# Altium project AAS_module_rev1_2.PrjPcb
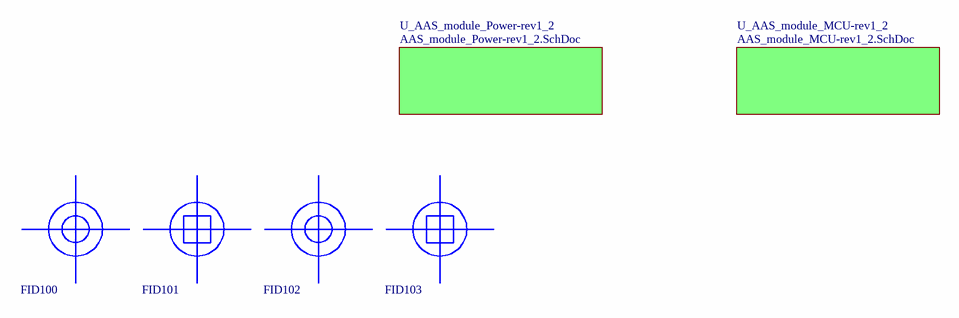
[diagram p0: AAS_module_TOP-rev1_2.SchDoc]
ProjecTevisionDate: 14; ProjectNameText: AAS module / Gateway; ProjectRevision: 1.2
4 sheets, 126 parts. Net scope: hierarchical (ports join the sheet entries above them; power ports are global).
Board files: AAS_module_rev1_2.PcbDoc, AAS_module_rev1_2_PANEL.PcbDoc
Sheets:
  AAS_module_TOP-rev1_2.SchDoc
    U_AAS_module_Power-rev1_2 = AAS_module_Power-rev1_2.SchDoc
    U_AAS_module_MCU-rev1_2 = AAS_module_MCU-rev1_2.SchDoc
      Designator = AAS_module_Touch-rev1_2.SchDoc

## Sheet AAS_module_TOP-rev1_2.SchDoc: TOP
size A4; Author: Richard Kubíček; DocumentNumber: 1; SheetNumber: 1; SheetTotal: 4; PageSize: A4; DruhPraceRadek1: Diplomová; DruhPraceRadek2: práce

### Parts
FID100  FID_CIRCLE  [FID-CIRCLE1MM]  (value not drawn)
FID101  FID_SQUARE  [FID-SQUARE1MM]  (value not drawn)
FID102  FID_CIRCLE  [FID-CIRCLE1MM]  (value not drawn)
FID103  FID_SQUARE  [FID-SQUARE1MM]  (value not drawn)

### Sub-sheets
U_AAS_module_MCU-rev1_2 = AAS_module_MCU-rev1_2.SchDoc: no entries
U_AAS_module_Power-rev1_2 = AAS_module_Power-rev1_2.SchDoc: no entries

### Notes on the sheet
- Druh práce
- Název dokumentu
- Projekt
- Autor
- Revize
- Strana

## Sheet AAS_module_Power-rev1_2.SchDoc: Power
size A3; Author: Richard Kubíček; DocumentNumber: 4; SheetNumber: 4; SheetTotal: 4; PageSize: A3; DruhPraceRadek1: Diplomová; DruhPraceRadek2: práce
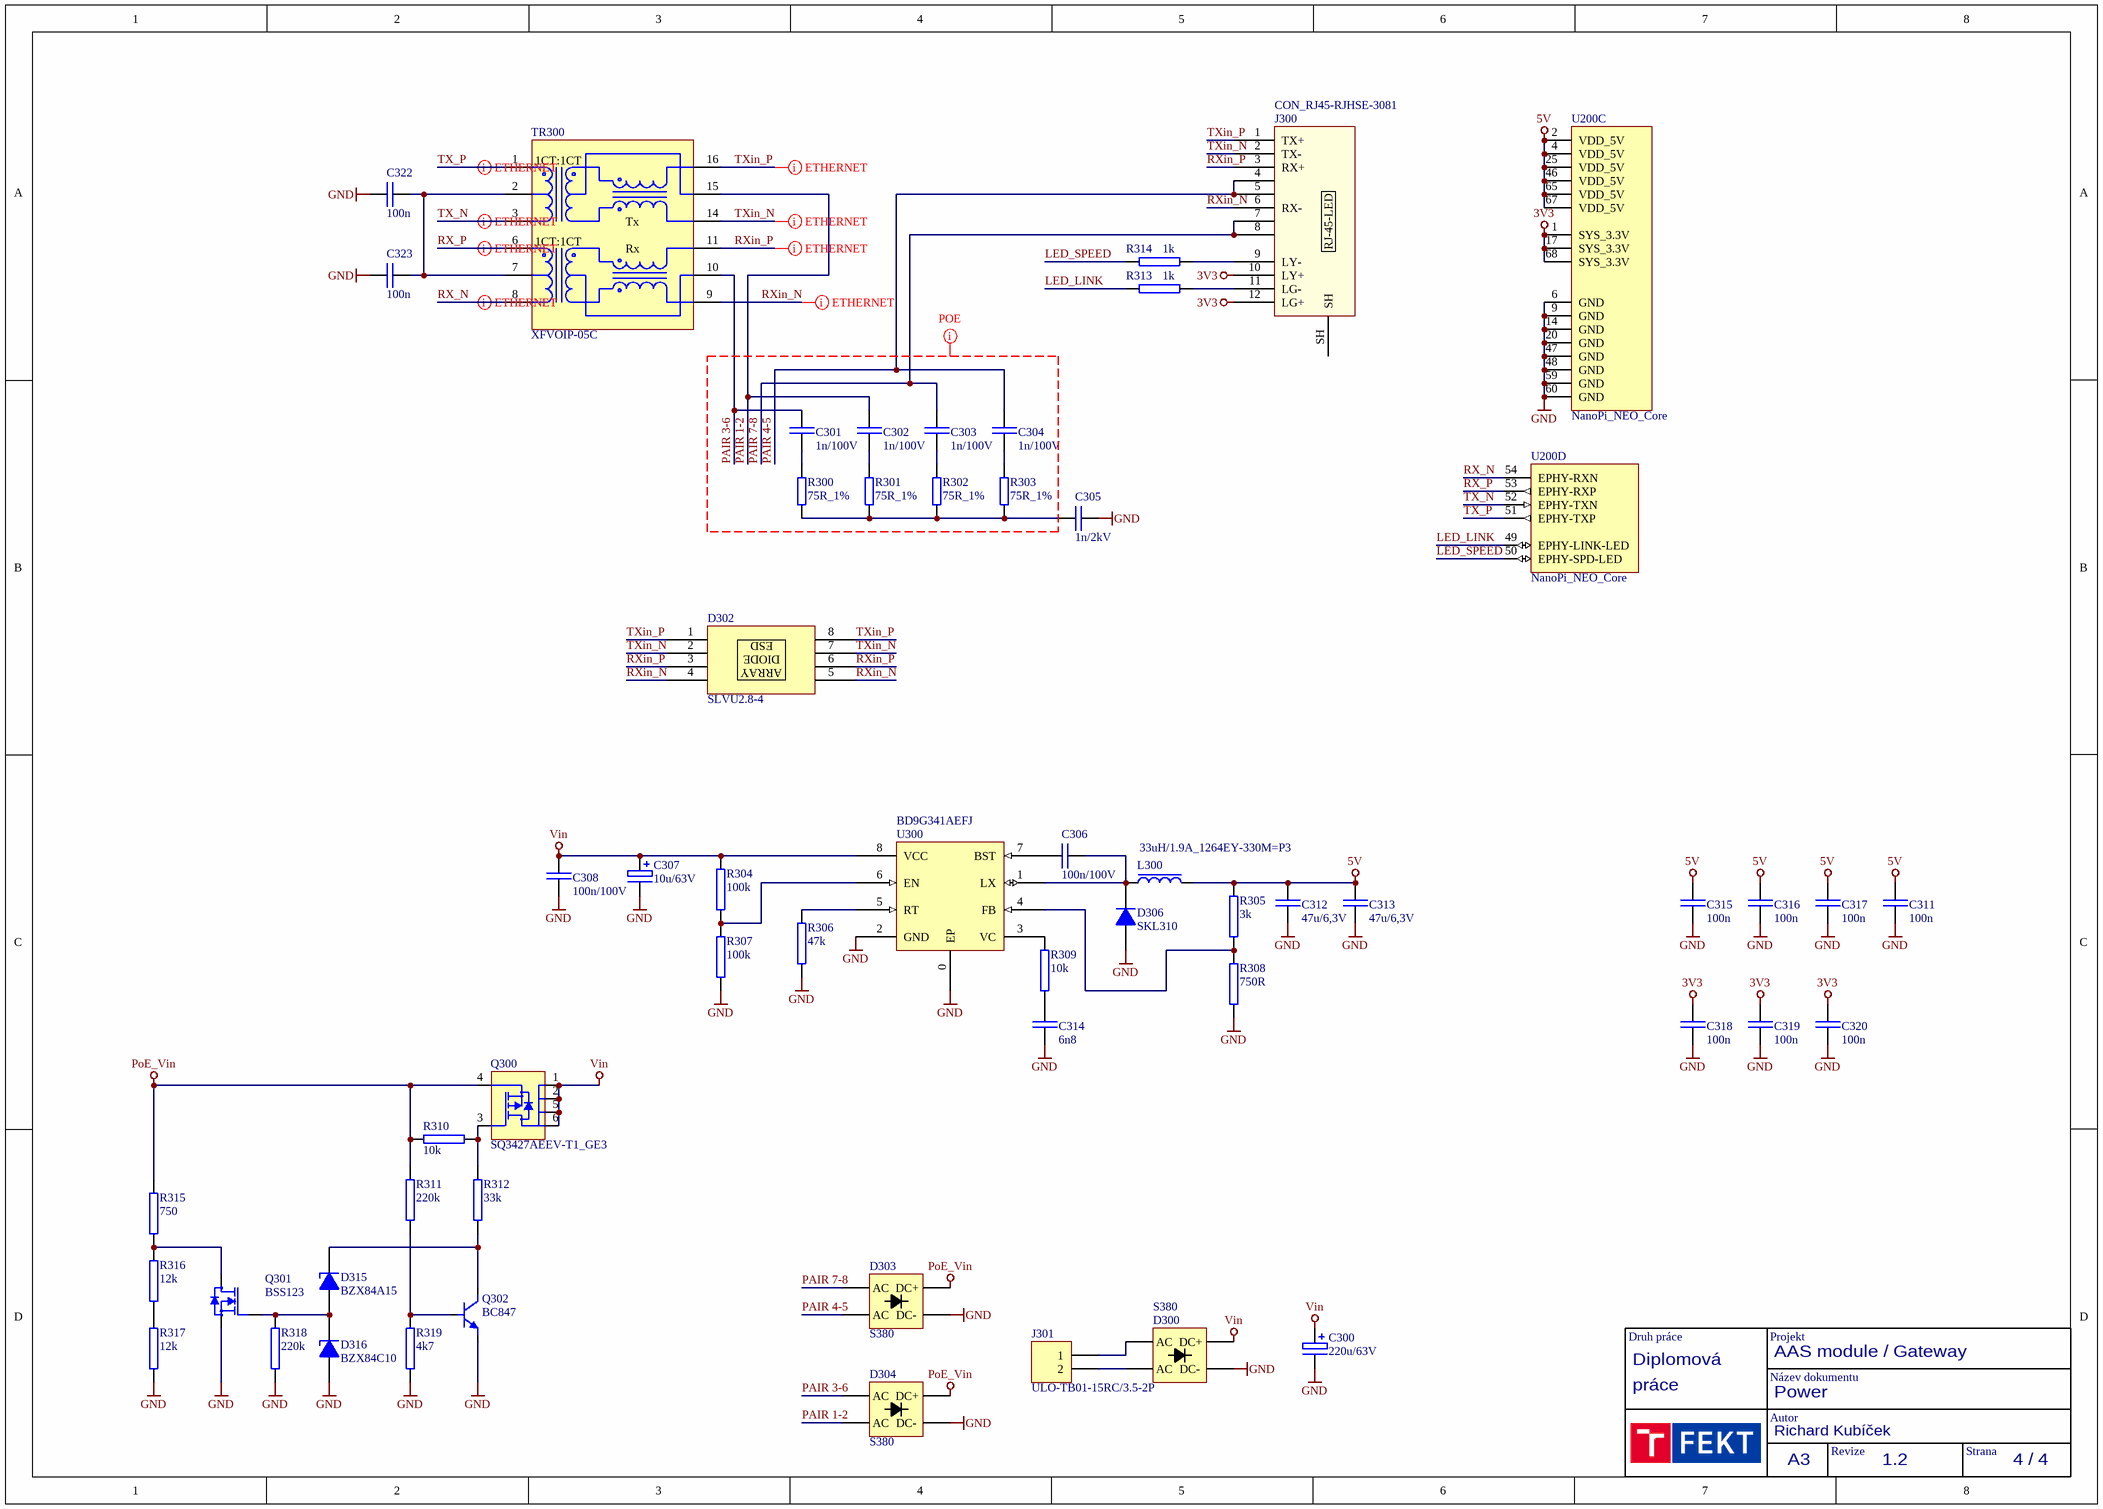
[diagram p1: AAS_module_Power-rev1_2.SchDoc]

### Parts
C300  220u/63V  [CAP_D10xL20_P5_HR]
C301  1n/100V  [C0603]
C302  1n/100V  [C0603]
C303  1n/100V  [C0603]
C304  1n/100V  [C0603]
C305  1n/2kV  [C1206]
C306  100n/100V  [C1206]
C307  10u/63V  [C_ALU_D6x5.8]
C308  100n/100V  [C1206]
C311  100n  [C0603]
C312  47u/6,3V  [C1206]
C313  47u/6,3V  [C1206]
C314  6n8  [C0805]
C315  100n  [C0603]
C316  100n  [C0603]
C317  100n  [C0603]
C318  100n  [C0603]
C319  100n  [C0603]
C320  100n  [C0603]
C322  100n  [C0603]
C323  100n  [C0603]
D300  S380  [MBS]
D302  SLVU2.8-4  [SO-8]
D303  S380  [MBS]
D304  S380  [MBS]
D306  SKL310  [SOD123]
D315  BZX84A15  [SOT-23]
D316  BZX84C10  [SOT-23]
J300  CON_RJ45-RJHSE-3081  [RJHSE-3081]
J301  ULO-TB01-15RC/3.5-2P  [ULO-TB01-15VC-3.5-2P]
L300  33uH/1.9A_1264EY-330M=P3  [L_MURATA-DG6050C]
Q300  SQ3427AEEV-T1_GE3  [SOT-23-6]
Q301  BSS123  [SOT-23]
Q302  BC847  [SOT-23]
R300  75R_1%  [R_0805]
R301  75R_1%  [R_0805]
R302  75R_1%  [R_0805]
R303  75R_1%  [R_0805]
R304  100k  [R0603]
R305  3k  [R0603]
R306  47k  [R0603]
R307  100k  [R0603]
R308  750R  [R0603]
R309  10k  [R0603]
R310  10k  [R0603]
R311  220k  [R0603]
R312  33k  [R0603]
R313  1k  [R0603]
R314  1k  [R0603]
R315  750  [R0603]
R316  12k  [R0603]
R317  12k  [R0603]
R318  220k  [R0603]
R319  4k7  [R0603]
TR300  XFVOIP-05C  [XFVOIP-05]
U200  NanoPi_NEO_Core  [NanoPi_NEO_Core_right]  (parts C,D of 4)
U300  BD9G341AEFJ  [SO-8_EP]

### Nets
3V3: C318.1 C319.1 C320.1 J300.10(LY+) J300.12(LG+) U200.1(SYS_3.3V) U200.17(SYS_3.3V) U200.68(SYS_3.3V)
5V: C311.1 C312.1 C313.1 C315.1 C316.1 C317.1 L300.2 R305.2 U200.2(VDD_5V) U200.4(VDD_5V) U200.25(VDD_5V) U200.46(VDD_5V) U200.65(VDD_5V) U200.67(VDD_5V)
GND: C300.2(-) C305.2 C307.2(-) C308.2 C311.2 C312.2 C313.2 C314.1 C315.2 C316.2 C317.2 C318.2 C319.2 C320.2 C322.1 C323.1 D300.2(DC-) D303.2(DC-) D304.2(DC-) D306.A D316.A Q301.S Q302.E R306.1 R307.1 R308.1 R317.1 R318.1 R319.1 U200.6(GND) U200.9(GND) U200.14(GND) U200.20(GND) U200.47(GND) U200.48(GND) U200.59(GND) U200.60(GND) U300.0(EP) U300.2(GND)
PoE_Vin: D303.1(DC+) D304.1(DC+) Q300.4(S) R310.2 R311.2 R315.2
Vin: C300.1(+) C307.1(+) C308.1 D300.1(DC+) Q300.1(D) Q300.2(D) Q300.5(D) Q300.6(D) R304.2 U300.8(VCC)
LED_LINK: R313.2 U200.49(EPHY-LINK-LED)
LED_SPEED: R314.2 U200.50(EPHY-SPD-LED)
PAIR 1-2: C302.1 D304.4(AC) TR300.15(TXCT)
PAIR 3-6: C301.1 D304.3(AC) TR300.10(RXCT)
PAIR 4-5: C304.1 D303.4(AC) J300.4 J300.5
PAIR 7-8: C303.1 D303.3(AC) J300.7 J300.8
RX_N: TR300.8(RD-) U200.54(EPHY-RXN)
RX_P: TR300.6(RD+) U200.53(EPHY-RXP)
RXin_N: D302.4 D302.5 J300.6(RX-) TR300.9(RX1-)
RXin_P: D302.3 D302.6 J300.3(RX+) TR300.11(RX1+)
TX_N: TR300.3(TD-) U200.52(EPHY-TXN)
TX_P: TR300.1(TD+) U200.51(EPHY-TXP)
TXin_N: D302.2 D302.7 J300.2(TX-) TR300.14(TX1-)
TXin_P: D302.1 D302.8 J300.1(TX+) TR300.16(TX1+)
NetC301_2: C301.2 R300.2
NetC302_2: C302.2 R301.2
NetC303_2: C303.2 R302.2
NetC304_2: C304.2 R303.2
NetC305_1: C305.1 R300.1 R301.1 R302.1 R303.1
NetC306_1: C306.1 U300.7(BST)
NetC306_2: C306.2 D306.K L300.1 U300.1(LX)
NetC314_2: C314.2 R309.1
NetC322_2: C322.2 C323.2 TR300.2(TCT) TR300.7(RCT)
NetD300_3: D300.3(AC) J301.1
NetD300_4: D300.4(AC) J301.2
NetD315_A: D315.A D316.K Q301.G R318.2
NetD315_K: D315.K Q302.C R312.1
NetJ300_9: J300.9(LY-) R314.1
NetJ300_11: J300.11(LG-) R313.1
NetQ300_3: Q300.3(G) R310.1 R312.2
NetQ301_D: Q301.D R315.1 R316.2
NetQ302_B: Q302.B R311.1 R319.2
NetR304_1: R304.1 R307.2 U300.6(EN)
NetR305_1: R305.1 R308.2 U300.4(FB)
NetR306_2: R306.2 U300.5(RT)
NetR309_2: R309.2 U300.3(VC)
NetR316_1: R316.1 R317.2

Not connected (* = marked no-connect by the designer): J300 SH; TR300 4(NC) 5(NC) 12(NC) 13(NC)

### Layout directives
net class POE: PAIR 1-2, PAIR 3-6, PAIR 4-5, PAIR 7-8
differential pair: RX_N, RX_P, RXin_N, RXin_P, TX_N, TX_P, TXin_N, TXin_P

### Notes on the sheet
- Druh práce
- Název dokumentu
- Projekt
- Autor
- Revize
- Strana
- (in symbol CON_RJ45-LED_DESCRIPTION) RJ-45-LED
- (in symbol SLVU2.8-4) ESD; DIODE; ARRAY
- (in symbol XFVOIP-05) 1CT:1CT; Tx; Rx

### Library data of the parts
C300 = C_ELYT: Electrolytic Capacitor; TME: EGT477M1JI20RRSHP
C301-C304 C311 C315-C320 C322 C323 = C_0603: Capacitor SMD 0603
C305 C306 C308 C312 C313 = C_1206: Capacitor SMD 1206
C307 = C_ALU: Electrolytic Aluminium Capacitor
C314 = C_0805: Capacitor SMD 0805
D300 D303 D304 = _DIODE_BRIDGE_RECTIFIER: Diode rectifier
D302 = SLVU2.8-4: EPD TVS Diode Array  For ESD and Latch-Up Protection
D306 = 1N4007: Diode
D315 D316 = BZX84CXXX: Zener diode; pin to pad: A>1 K>3
J300 = CON_RJ45-LED_DESCRIPTION
J301 = CON_ULO-TB01-15RC/3.5-2P: Connector 15EDG pitch 3.5mm Right Angle
L300 = 44: ID: 44; ABRA number: 94369; UR: 1; Value: 1264EY-330M=P3; Induction: 33uH/1.9A; Technology: SMT; Supplier 1: https://cz.mouser.com/ProductDetail/Murata-Electronics/1264EY-330M%3dP3?qs=sGAEpiMZZMsg%252by3WlYCkU588IWvyRtFzXhS%252bh6Vmel8%3d
Q300 = 38: ID: 38; UR: 1; Value: SQ3427AEEV-T1_GE3; HelpURL: https://cz.mouser.com/ProductDetail/Vishay-Siliconix/SQ3427AEEV-T1_GE3?qs=sGAEpiMZZMshyDBzk1%2FWi7D7EaJfF%252Bz4Xfx7fw3JA1J5zUvCnpY8Yg%3D%3D; Technology: SMT
Q301 = BSS138: N-Channel MOSFET; pin to pad: D>3 G>1 S>2
Q302 = BC847: NPN Transistor; pin to pad: B>1 C>3 E>2
R300-R303 = 101: ID: 101; Value: 75R; Tolerance: 1; ABRA number: 120149; ABS: 75; Technology: SMT; UR: 1
R304-R319 = R_0603: Resistor SMD 0603
TR300 = XFVOIP-05: LAN magnetics with filter; LCSC: HY601742
U300 = BD9G341AEFJ: 12V to 76V input voltage range 3A output current

## Sheet AAS_module_MCU-rev1_2.SchDoc: MCU
size A3; Author: Richard Kubíček; DocumentNumber: 2; SheetNumber: 2; SheetTotal: 4; PageSize: A3; DruhPraceRadek1: Diplomová; DruhPraceRadek2: práce
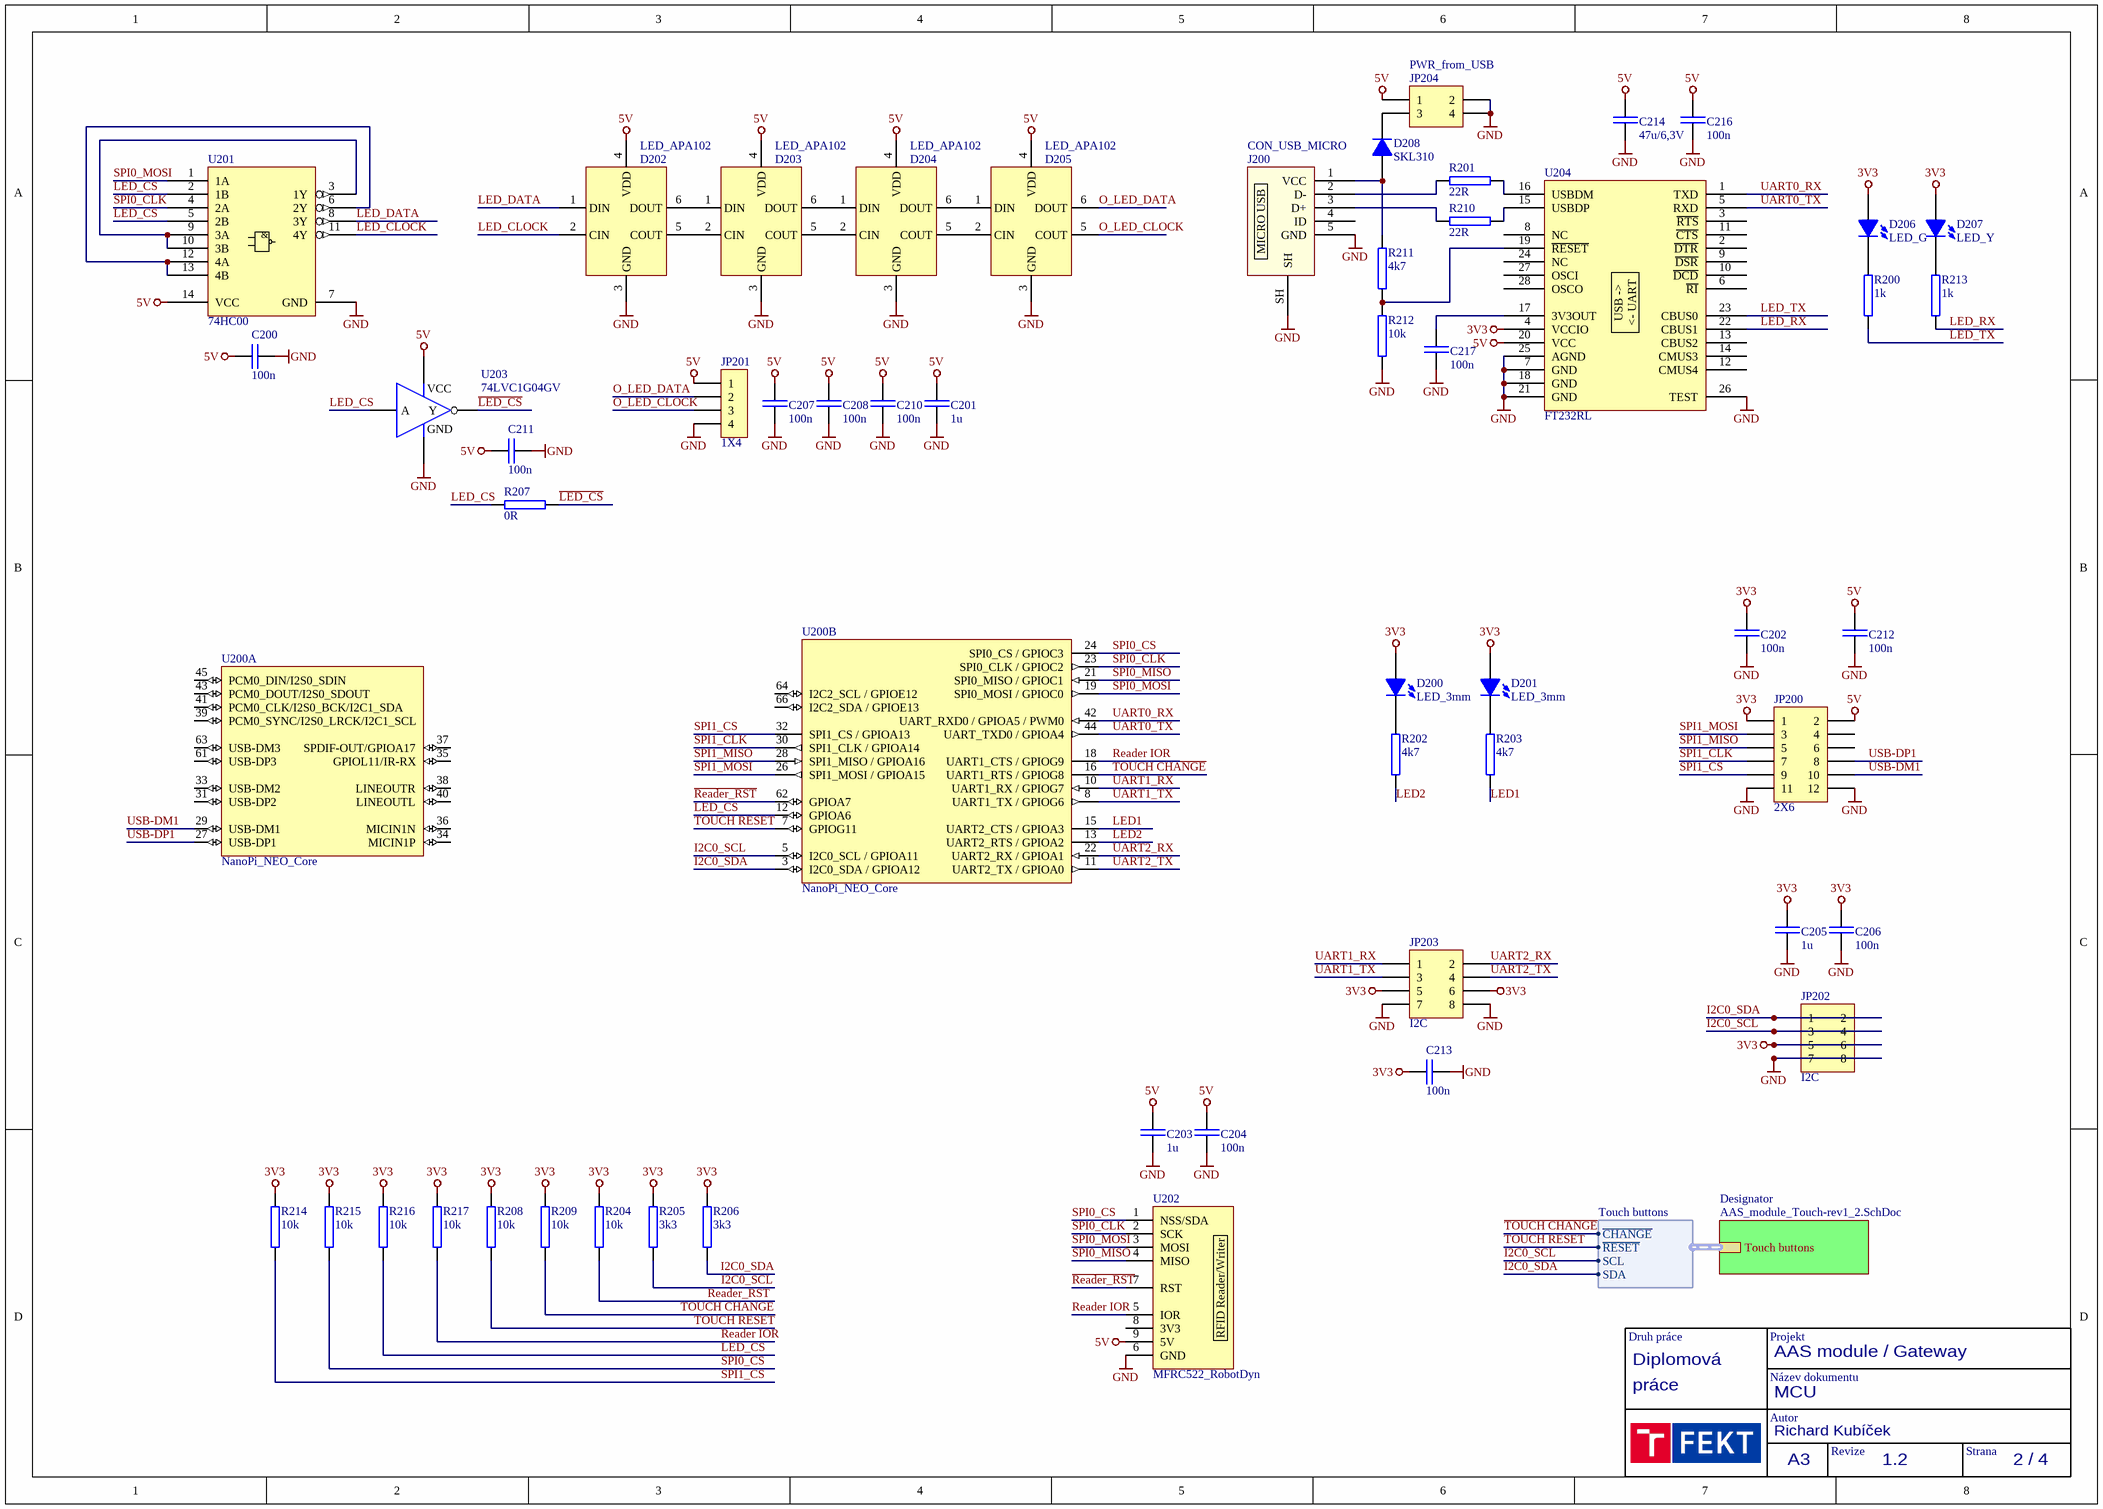
[diagram p2: AAS_module_MCU-rev1_2.SchDoc]

### Parts
C200  100n  [C0603]
C201  1u  [C0603]
C202  100n  [C0603]
C203  1u  [C0603]
C204  100n  [C0603]
C205  1u  [C0603]
C206  100n  [C0603]
C207  100n  [C0603]
C208  100n  [C0603]
C210  100n  [C0603]
C211  100n  [C0603]
C212  100n  [C0603]
C213  100n  [C0603]
C214  47u/6,3V  [C1206]
C216  100n  [C0603]
C217  100n  [C0603]
D200  LED_3mm  [LED_THT_3MM_P2.5_GREEN]
D201  LED_3mm  [LED_THT_3MM_P2.5_GREEN]
D202  LED_APA102  [APA102]
D203  LED_APA102  [APA102]
D204  LED_APA102  [APA102]
D205  LED_APA102  [APA102]
D206  LED_G  [LED_0603]
D207  LED_Y  [LED_0603]
D208  SKL310  [SOD123]
J200  CON_USB_MICRO  [MICRO USB-B SMD]
JP200  2X6  [HDR2x6]
JP201  1X4  [HDR1X4]
JP202  I2C  [HDR2X4]
JP203  I2C  [HDR2X4]
JP204  PWR_from_USB  [HDR2X2A]
R200  1k  [R0603]
R201  22R  [R0603]
R202  4k7  [R0603]
R203  4k7  [R0603]
R204  10k  [R0603]
R205  3k3  [R0603]
R206  3k3  [R0603]
R207  0R  [R0603]
R208  10k  [R0603]
R209  10k  [R0603]
R210  22R  [R0603]
R211  4k7  [R0603]
R212  10k  [R0603]
R213  1k  [R0603]
R214  10k  [R0603]
R215  10k  [R0603]
R216  10k  [R0603]
R217  10k  [R0603]
U200  NanoPi_NEO_Core  [NanoPi_NEO_Core_right]  (parts A,B of 4)
U201  74HC00  [SO-14]
U202  MFRC522_RobotDyn  [MFRC522_RobotDyn]
U203  74LVC1G04GV  [SOT-25]
U204  FT232RL  [SSOP-28]

### Sub-sheets
Designator = AAS_module_Touch-rev1_2.SchDoc: Touch buttons (harness Touch buttons)

### Harnesses
Touch buttons: ~{CHANGE}, ~{RESET}, SCL, SDA

### Nets
3V3: C202.1 C205.1 C206.1 C213.1 D200.A D201.A D206.A D207.A JP200.1 JP202.5 JP202.6 JP203.5 JP203.6 R204.2 R205.2 R206.2 R208.2 R209.2 R214.2 R215.2 R216.2 R217.2 U204.4(VCCIO)
5V: C200.1 C201.1 C203.1 C204.1 C207.1 C208.1 C210.1 C211.1 C212.1 C214.1 C216.2 D202.4(VDD) D203.4(VDD) D204.4(VDD) D205.4(VDD) JP200.2 JP201.1 JP204.1 U201.14(VCC) U202.9(5V) U203.5(VCC) U204.20(VCC)
GND: C200.2 C201.2 C202.2 C203.2 C204.2 C205.2 C206.2 C207.2 C208.2 C210.2 C211.2 C212.2 C213.2 C214.2 C216.1 C217.1 D202.3(GND) D203.3(GND) D204.3(GND) D205.3(GND) J200.5(GND) J200.SH JP200.11 JP200.12 JP201.4 JP202.7 JP202.8 JP203.7 JP203.8 JP204.2 JP204.4 R212.2 U201.7(GND) U202.6(GND) U203.3(GND) U204.7(GND) U204.18(GND) U204.21(GND) U204.25(AGND) U204.26(TEST)
I2C0_SCL: JP202.3 JP202.4 R205.1 U200.5(I2C0_SCL_/_GPIOA11) ; sheet Designator/Touch buttons.SCL
I2C0_SDA: JP202.1 JP202.2 R206.1 U200.3(I2C0_SDA_/_GPIOA12) ; sheet Designator/Touch buttons.SDA
~{LED_CS}: R207.1 U201.2(1B) U201.5(2B) U203.4(Y)
LED1: R203.1 U200.15(UART2_CTS_/_GPIOA3)
LED2: R202.1 U200.13(UART2_RTS_/_GPIOA2)
LED_CLOCK: D202.2(CIN) U201.11(4Y)
LED_CS: R207.2 R216.1 U200.12(GPIOA6) U203.2(A)
LED_DATA: D202.1(DIN) U201.8(3Y)
LED_RX: R213.1 U204.22(CBUS1)
LED_TX: R200.1 U204.23(CBUS0)
O_LED_CLOCK: D205.5(COUT) JP201.3
O_LED_DATA: D205.6(DOUT) JP201.2
~{Reader_RST}: R204.1 U200.62(GPIOA7) U202.7(RST)
Reader IOR: R217.1 U200.18(UART1_CTS_/_GPIOG9) U202.5(IOR)
SPI0_CLK: U200.23(SPI0_CLK_/_GPIOC2) U201.4(2A) U202.2(SCK)
SPI0_CS: R215.1 U200.24(SPI0_CS_/_GPIOC3) U202.1(NSS/SDA)
SPI0_MISO: U200.21(SPI0_MISO_/_GPIOC1) U202.4(MISO)
SPI0_MOSI: U200.19(SPI0_MOSI_/_GPIOC0) U201.1(1A) U202.3(MOSI)
SPI1_CLK: JP200.7 U200.30(SPI1_CLK_/_GPIOA14)
SPI1_CS: JP200.9 R214.1 U200.32(SPI1_CS_/_GPIOA13)
SPI1_MISO: JP200.5 U200.28(SPI1_MISO_/_GPIOA16)
SPI1_MOSI: JP200.3 U200.26(SPI1_MOSI_/_GPIOA15)
~{TOUCH CHANGE}: R209.1 U200.16(UART1_RTS_/_GPIOG8) ; sheet Designator/Touch buttons.~{CHANGE}  [project net ~{CHANGE}]
~{TOUCH RESET}: R208.1 U200.7(GPIOG11) ; sheet Designator/Touch buttons.~{RESET}  [project net ~{RESET}]
UART0_RX: U200.42(UART_RXD0_/_GPIOA5_/_PWM0) U204.1(TXD)
UART0_TX: U200.44(UART_TXD0_/_GPIOA4) U204.5(RXD)
UART1_RX: JP203.1 U200.10(UART1_RX_/_GPIOG7)
UART1_TX: JP203.3 U200.8(UART1_TX_/_GPIOG6)
UART2_RX: JP203.2 U200.22(UART2_RX_/_GPIOA1)
UART2_TX: JP203.4 U200.11(UART2_TX_/_GPIOA0)
USB-DM1: JP200.10 U200.29(USB-DM1)
USB-DP1: JP200.8 U200.27(USB-DP1)
NetC217_2: C217.2 U204.17(3V3OUT)
NetD200_K: D200.K R202.2
NetD201_K: D201.K R203.2
NetD202_5: D202.5(COUT) D203.2(CIN)
NetD202_6: D202.6(DOUT) D203.1(DIN)
NetD203_5: D203.5(COUT) D204.2(CIN)
NetD203_6: D203.6(DOUT) D204.1(DIN)
NetD204_5: D204.5(COUT) D205.2(CIN)
NetD204_6: D204.6(DOUT) D205.1(DIN)
NetD206_K: D206.K R200.2
NetD207_K: D207.K R213.2
NetD208_A: D208.A J200.1(VCC) R211.1
NetD208_K: D208.K JP204.3
NetJ200_2: J200.2(D-) R201.1
NetJ200_3: J200.3(D+) R210.1
NetR201_2: R201.2 U204.16(USBDM)
NetR210_2: R210.2 U204.15(USBDP)
NetR211_2: R211.2 R212.1 U204.19(~{RESET})
NetU201_3: U201.3(1Y) U201.9(3A) U201.10(3B)
NetU201_6: U201.6(2Y) U201.12(4A) U201.13(4B)

Not connected (* = marked no-connect by the designer): J200 4(ID); JP200 4 6; U200 31(USB-DP2) 33(USB-DM2) 34(MICIN1P) 35(GPIOL11/IR-RX) 36(MICIN1N) 37(SPDIF-OUT/GPIOA17) 38(LINEOUTR) 39(PCM0_SYNC/I2S0_LRCK/I2C1_SCL) 40(LINEOUTL) 41(PCM0_CLK/I2S0_BCK/I2C1_SDA) 43(PCM0_DOUT/I2S0_SDOUT) 45(PCM0_DIN/I2S0_SDIN) 61(USB-DP3) 63(USB-DM3) 64(I2C2_SCL_/_GPIOE12) 66(I2C2_SDA_/_GPIOE13); U202 8(3V3); U203 1(NC); U204 2(~{DTR}) 3(~{RTS}) 6(~{RI}) 8(NC) 9(~{DSR}) 10(~{DCD}) 11(~{CTS}) 12(CMUS4) 13(CBUS2) 14(CMUS3) 24(NC) 27(OSCI) 28(OSCO)

### Notes on the sheet
- Druh práce
- Název dokumentu
- Projekt
- Autor
- Revize
- Strana
- (in symbol 74HC00) &
- (in symbol CON_USB_MICRO) MICRO USB
- (in symbol FT232RL) USB ->; <- UART
- (in symbol MFRC522_RobotDyn) RFID Reader/Writer

### Library data of the parts
C200-C208 C210-C213 C216 C217 = C_0603: Capacitor SMD 0603
C214 = C_1206: Capacitor SMD 1206
D200 D201 = LED_3mm: LED 3mm
D202-D205 = LED_APA102: Intelligent control LED integrated light source
D206 D207 = LED_0603: LED SMD 0603
D208 = 1N4007: Diode
JP200 = Header 2X6: Header, 12-Pin, Dual row
JP201 = Header 1X4: Header, 4-Pin, Single row
JP202 JP203 = Header 2X4: Header, 8-Pin, Dual row
JP204 = Header 2X2: Header, 6-Pin, Dual row
R200-R217 = R_0603: Resistor SMD 0603
U201 = 74HC00: Quad 2-input NAND gate
U203 = 8: Single inverter; ID: 8; ABRA number: 92285; Value: 74LVC1G04GV; Technology: SMT
U204 = FT232RL: USB Interface IC USB to Serial UART Enhanced IC
U202 = MFRC522_RobotDyn: Part Field 2: CORE; Part Field 3: BOTTOM; Part Field 4: AUTOMAT

## Sheet AAS_module_Touch-rev1_2.SchDoc: Touch controller
size A4; Author: Richard Kubíček; DocumentNumber: 3; SheetNumber: 3; SheetTotal: 4; PageSize: A4; DruhPraceRadek1: Diplomová; DruhPraceRadek2: práce
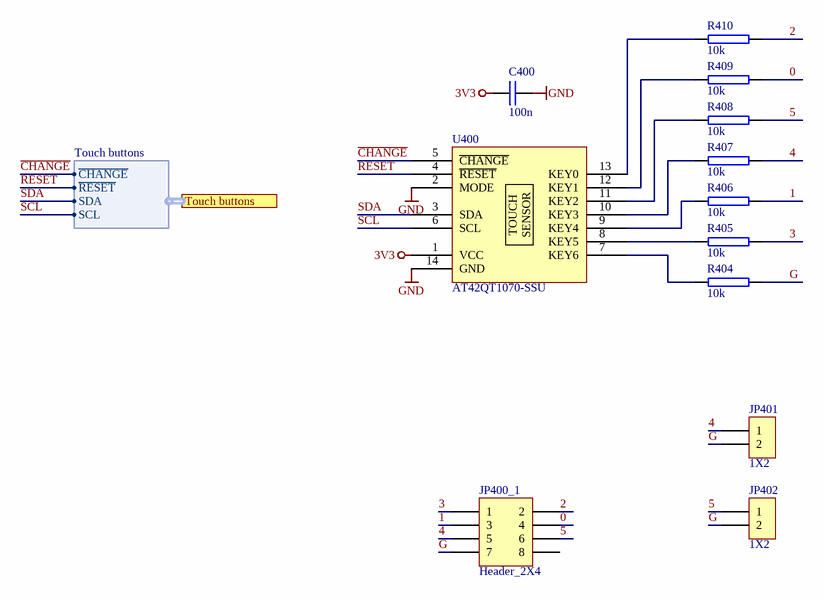
[diagram p3: AAS_module_Touch-rev1_2.SchDoc]

### Parts
C400  100n  [C0603]
JP400_1  Header_2X4  [HDR2X4]
JP401  1X2  [HDR1X2]
JP402  1X2  [HDR1X2]
R404  10k  [R0603]
R405  10k  [R0603]
R406  10k  [R0603]
R407  10k  [R0603]
R408  10k  [R0603]
R409  10k  [R0603]
R410  10k  [R0603]
U400  AT42QT1070-SSU  [SO-14]

### Ports
Touch buttons (harness Touch buttons)

### Harnesses
Touch buttons: ~{CHANGE}, ~{RESET}, SDA, SCL

### Nets
3V3: C400.1 U400.1(VCC)
GND: C400.2 U400.2(MODE) U400.14(GND)
0: JP400_1.4 R409.2
1: JP400_1.3 R406.2
2: JP400_1.2 R410.2
3: JP400_1.1 R405.2
4: JP400_1.5 JP401.1 R407.2
5: JP400_1.6 JP402.1 R408.2
~{CHANGE}: U400.5(~{CHANGE}) ; port Touch buttons.~{CHANGE}
G: JP400_1.7 JP401.2 JP402.2 R404.2
~{RESET}: U400.4(~{RESET}) ; port Touch buttons.~{RESET}
SCL: U400.6(SCL) ; port Touch buttons.SCL  [project net I2C0_SCL]
SDA: U400.3(SDA) ; port Touch buttons.SDA  [project net I2C0_SDA]
NetR404_1: R404.1 U400.7(KEY6)
NetR405_1: R405.1 U400.8(KEY5)
NetR406_1: R406.1 U400.9(KEY4)
NetR407_1: R407.1 U400.10(KEY3)
NetR408_1: R408.1 U400.11(KEY2)
NetR409_1: R409.1 U400.12(KEY1)
NetR410_1: R410.1 U400.13(KEY0)

Not connected (* = marked no-connect by the designer): JP400_1 8

### Notes on the sheet
- Druh práce
- Název dokumentu
- Projekt
- Autor
- Revize
- Strana
- (in symbol AT42QT1070-SSU) TOUCH; SENSOR

### Library data of the parts
C400 = C_0603: Capacitor SMD 0603
JP400_1 = 19: Header dual row; ID: 19; UR: 0,1; ABRA number: 120430; Value: Header_2X4; Technology: THT
JP401 JP402 = Header 1X2: Header, 2-Pin, Single row
R404-R410 = R_0603: Resistor SMD 0603
U400 = AT42QT1070-SSU: Seven-channel QTouch® Touch Sensor IC

## Nets that join several sheets
3V3: AAS_module_Power-rev1_2 (8 pins), AAS_module_MCU-rev1_2 (23 pins), AAS_module_Touch-rev1_2 (C400.1 U400.1)
5V: AAS_module_Power-rev1_2 (14 pins), AAS_module_MCU-rev1_2 (22 pins)
GND: AAS_module_Power-rev1_2 (39 pins), AAS_module_MCU-rev1_2 (40 pins), AAS_module_Touch-rev1_2 (C400.2 U400.2 U400.14)
~{CHANGE}: AAS_module_MCU-rev1_2 (R209.1 U200.16), AAS_module_Touch-rev1_2 (U400.5)
I2C0_SCL: AAS_module_MCU-rev1_2 (JP202.3 JP202.4 R205.1 U200.5), AAS_module_Touch-rev1_2 (U400.6)
I2C0_SDA: AAS_module_MCU-rev1_2 (JP202.1 JP202.2 R206.1 U200.3), AAS_module_Touch-rev1_2 (U400.3)
~{RESET}: AAS_module_MCU-rev1_2 (R208.1 U200.7), AAS_module_Touch-rev1_2 (U400.4)

## Assembly variants
STD: not fitted D206 D207 J200 JP204 U203 U204